# EAGLE design maze_board (EAGLE 9.2.2)
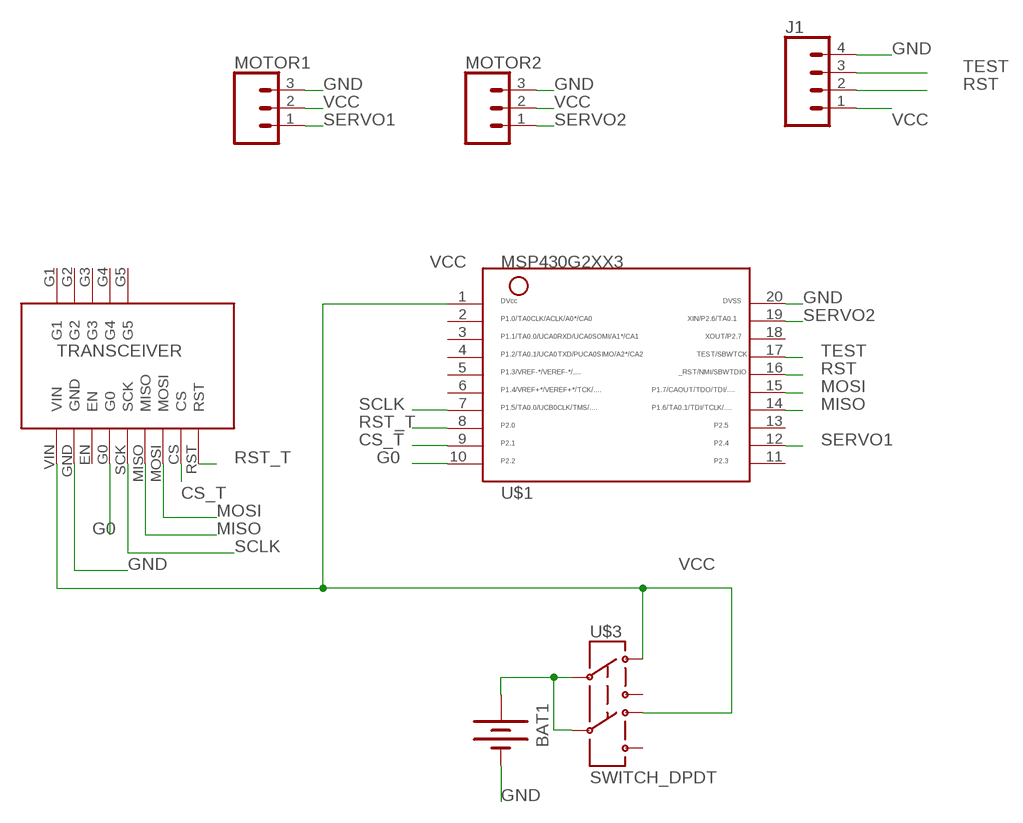
[diagram p0: schematic, sheet 1]

## Parts
BAT1  BATTERY  [BATTERY_PACK_2AA]
J1  CONN_04LOCK  [1X04_LOCK]
MOTOR1  CONN_03LOCK  [1X03_LOCK]
MOTOR2  CONN_03LOCK  [1X03_LOCK]
U$1  MSP430G2XX3TSSOP  [PW20]
U$3  SWITCH_DPDT  [JS_DPDT_TH]
U$4  ADAFRUIT-RFM69HCW-TRANSCEIVER  [ADAFRUIT-RFM69HCW-TRANSCEIVER]

## Nets
CS_T: U$1.9 U$4.CS
G0: U$1.10 U$4.G0
GND: BAT1.GND(-) J1.4 MOTOR1.3 MOTOR2.3 U$1.20 U$4.GND
MISO: U$1.14 U$4.MISO
MOSI: U$1.15 U$4.MOSI
N$2: BAT1.3V(+) U$3.2 U$3.5
RST: J1.2 U$1.16
RST_T: U$1.8 U$4.RST
SCLK: U$1.7 U$4.SCK
SERVO1: MOTOR1.1 U$1.12
SERVO2: MOTOR2.1 U$1.19
TEST: J1.3 U$1.17
VCC: J1.1 MOTOR1.2 MOTOR2.2 U$1.1 U$3.1 U$3.4 U$4.VIN
Unconnected: U$1.2 U$1.3 U$1.4 U$1.5 U$1.6 U$1.11 U$1.13 U$1.18 U$3.3 U$3.6 U$4.EN U$4.G1 U$4.G2 U$4.G3 U$4.G4 U$4.G5

## Library data of the parts
BAT1 = ELEC327:BATTERY: Battery Holders Various common sizes : AA, AAA, 20mm coin cell and 12mm coin cell. 20MM_4LEGS, BATT-10373
J1 = SparkFun-Connectors:CONN_04: Multi connection point. Often used as Generic Header-pin footprint for 0.1 inch spaced/style header connections On any of the 0.1 inch spaced packages, you can populate with these: Break Away Headers - Straight <https://www.sparkfun.com/products/116> (PRT-00116) Break Away Male Headers - Right Angle <https://www.sparkfun.com/products/553> (PRT-00553) Female Headers <https://www.sparkfun.com/products/115> (PRT-00115) Break Away Headers - Machine Pin <https://www.sparkfun.com/products/117> (PRT-00117) Break Away Female Headers - Swiss Machine Pin <https://www.sparkfun.com/products/743> (PRT-00743) For SCREWTERMINALS and SPRING TERMINALS visit here: Screw Terimnals on SparkFun.com <https://www.sparkfun.com/search/results?term=Screw+Terminals> (5mm/3.5mm/2.54mm spacing) This device is also useful as a general connection point to wire up your design to another part of your project. Our various solder wires solder well into these plated through hole pads. Hook-Up Wire - Assortment (Stranded, 22 AWG) <https://www.sparkfun.com/products/11375> (PRT-11375) Hook-Up Wire - Assortment (Solid Core, 22 AWG) <https://www.sparkfun.com/products/11367> (PRT-11367) View the entire wire category on our website here <https://www.sparkfun.com/categories/141> Special notes: Molex polarized connector foot print use with SKU : PRT-08231 with associated crimp pins and housings. 1MM SMD Version SKU: PRT-10208; PROD_ID: CONN-09696
MOTOR1 MOTOR2 = SparkFun-Connectors:CONN_03: Multi connection point. Often used as Generic Header-pin footprint for 0.1 inch spaced/style header connections On any of the 0.1 inch spaced packages, you can populate with these: Break Away Headers - Straight <https://www.sparkfun.com/products/116> (PRT-00116) Break Away Male Headers - Right Angle <https://www.sparkfun.com/products/553> (PRT-00553) Female Headers <https://www.sparkfun.com/products/115> (PRT-00115) Break Away Headers - Machine Pin <https://www.sparkfun.com/products/117> (PRT-00117) Break Away Female Headers - Swiss Machine Pin <https://www.sparkfun.com/products/743> (PRT-00743) Stackable Header - 3 Pin (Female, 0.1") <https://www.sparkfun.com/products/13875> (PRT-13875) For SCREWTERMINALS and SPRING TERMINALS visit here: Screw Terimnals on SparkFun.com <https://www.sparkfun.com/search/results?term=Screw+Terminals> (5mm/3.5mm/2.54mm spacing) This device is also useful as a general connection point to wire up your design to another part of your project. Our various solder wires solder well into these plated through hole pads. Hook-Up Wire - Assortment (Stranded, 22 AWG) <https://www.sparkfun.com/products/11375> (PRT-11375) Hook-Up Wire - Assortment (Solid Core, 22 AWG) <https://www.sparkfun.com/products/11367> (PRT-11367) View the entire wire category on our website here <https://www.sparkfun.com/categories/141> Special notes: Molex polarized connector foot print use with SKU : PRT-08232 with associated crimp pins and housings.
U$1 = ELEC327:MSP430G2XX3: MSP430G2XX3 PDIP (N) 20 Pin Package
U$3 = ELEC327:SWITCH_DPDT
U$4 = patrickELEC327:ADAFRUIT-RFM69HCW-TRANSCEIVER

## Board
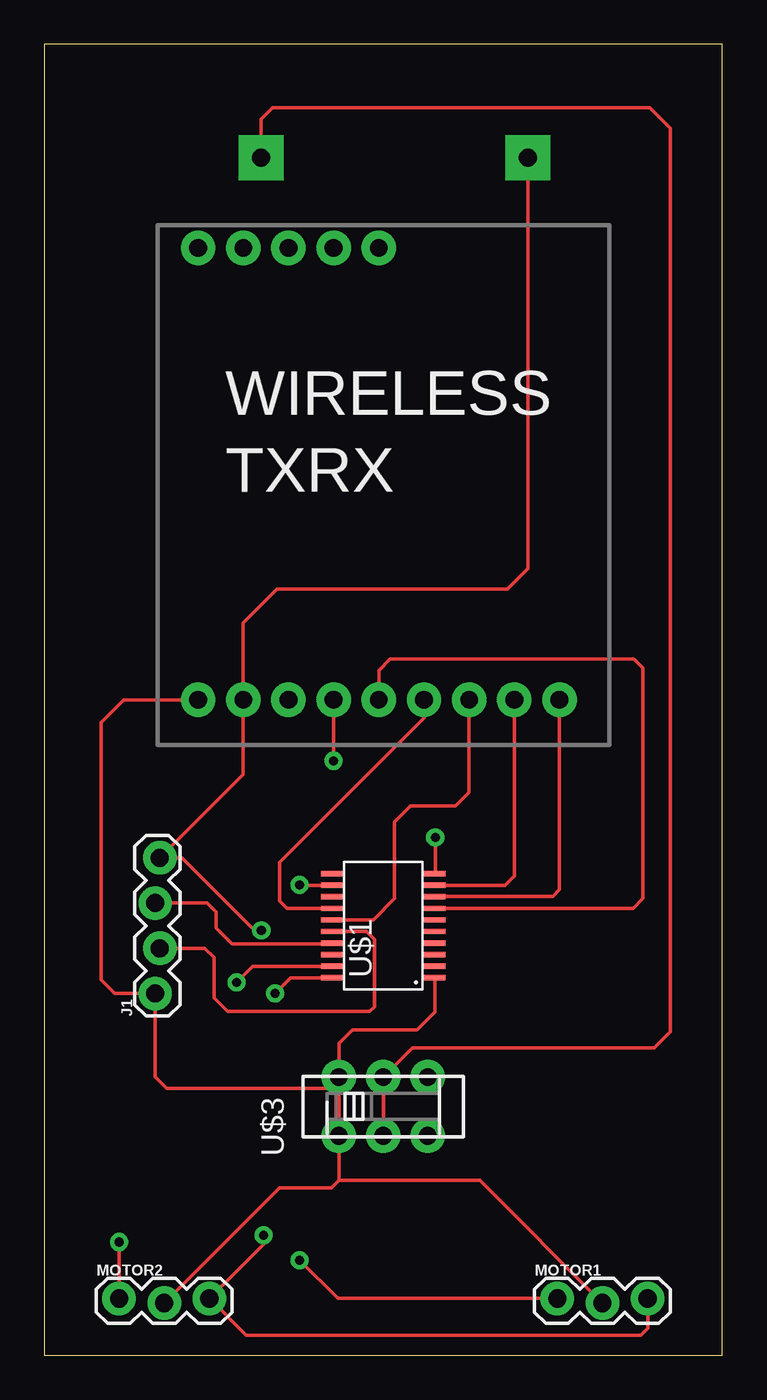
[diagram p1: board, top side]
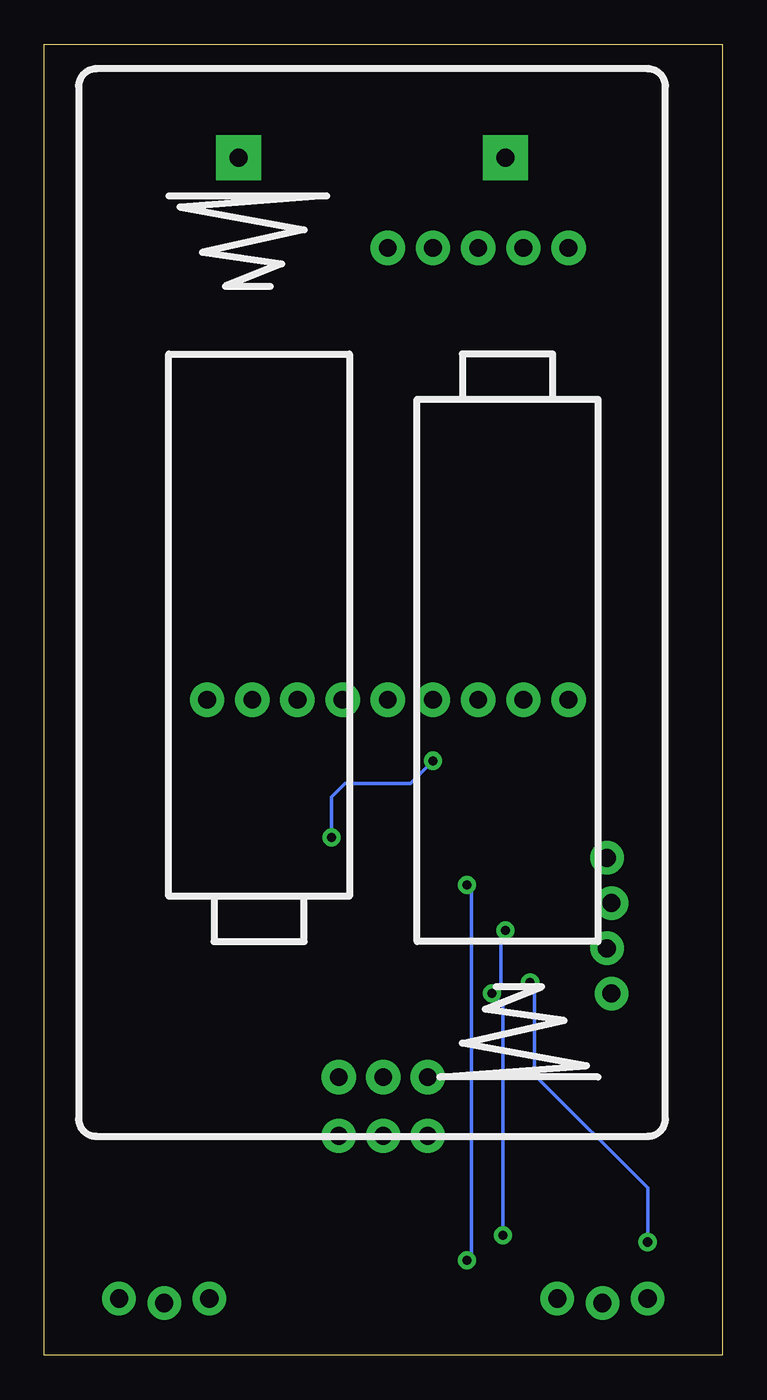
[diagram p2: board, bottom side, seen from below]

Size 38.1 x 73.66 mm. Coordinates in mm from the lower left corner, seen from the top.
Outline: 0,0 38.1,0 38.1,73.66 0,73.66 0,0
Copper layers (1*16): Top 0.035mm / dielectric 1.5mm / Bottom 0.035mm
Design rules "AdvancedCircuitsBarebones": minimum track width 6mil, minimum drill 20mil, track to track 6mil, track to pad 6mil, pad to pad 6mil, via to via 6mil, smd to smd 6mil, copper to edge 10mil, drill to drill 6mil, minimum pad ring 12mil, minimum via ring 10mil, stop-mask expansion 4mil, vias tented up to drill 25mil, thermal gap 10mil

### Footprints (pad centres in the part's own frame; a part is rotated, then mirrored left to right if it is on the bottom)
BATTERY_PACK_2AA = drill 1 pad 2.54 square: 3V 7.5,25; GND -7.5,25
1X04_LOCK = drill 1.016 pad 1.88: 1 0,0.127; 2 2.54,-0.127; 3 5.08,0.127; 4 7.62,-0.127
1X03_LOCK = drill 1.016 pad 1.88: 1 0,0.127; 2 2.54,-0.127; 3 5.08,0.127
PW20 = smd 0.3 x 1.2: 1 -2.925,-2.9; 2 -2.275,-2.9; 3 -1.625,-2.9; 4 -0.975,-2.9; 5 -0.325,-2.9; 6 0.325,-2.9; 7 0.975,-2.9; 8 1.625,-2.9; 9 2.275,-2.9; 10 2.925,-2.9; 11 2.925,2.9; 12 2.275,2.9; 13 1.625,2.9; 14 0.975,2.9; 15 0.325,2.9; 16 -0.325,2.9; 17 -0.975,2.9; 18 -1.625,2.9; 19 -2.275,2.9; 20 -2.925,2.9
JS_DPDT_TH = drill 1 pad 1.93: 1 -2.5,-1.65; 2 0,-1.65; 3 2.5,-1.65; 4 -2.5,1.65; 5 0,1.65; 6 2.5,1.65
ADAFRUIT-RFM69HCW-TRANSCEIVER = drill 1 pad 1.93: CS 20.066,-26.67; EN 7.366,-26.67; G0 9.906,-26.67; G1 2.286,-1.27; G2 4.826,-1.27; G3 7.366,-1.27; G4 9.906,-1.27; G5 12.446,-1.27; GND 4.826,-26.67; MISO 14.986,-26.67; MOSI 17.526,-26.67; RST 22.606,-26.67; SCK 12.446,-26.67; VIN 2.286,-26.67

### Placement (x,y rotation side)
BAT1  19.68,42.29 0 bottom
J1  6.35,20.32 90 top
MOTOR1  28.83,3.05 0 top
MOTOR2  4.19,3.05 0 top
U$1  19.05,24.13 90 top
U$3  19.05,13.97 0 top
U$4  6.35,63.5 0 top

### Tracks (layer width: path | path; a pad name or v marks a point on that pad's centre or on a via)
CS_T
  Top 0.203: U$1.9 25.9,26.41 26.42,26.92 U$4.CS
G0  (via drill 0.51)
  Top 0.203: U$1.10 21.97,27.08 v21.97,29.08 | v16.26,33.4 U$4.G0
  Bottom 0.203: v21.97,29.08 21.97,31.37 21.21,32.13 17.53,32.13 v16.26,33.4
GND  (via drill 0.51)
  Top 0.203: v12.19,23.88 11.81,23.88 7.75,27.94 J1.4 11.18,32.64 U$4.GND 11.18,41.15 13.08,43.05 26.04,43.05 27.18,44.2 BAT1.GND | v12.95,20.32 13.84,21.21 U$1.20 | MOTOR1.3 33.91,1.5 33.53,1.12 11.33,1.12 MOTOR2.3 12.32,6.22 v12.32,6.73
  Bottom 0.203: v12.19,23.88 12.45,23.62 12.45,20.83 v12.95,20.32 12.32,19.68 v12.32,6.73
MISO
  Top 0.203: U$4.MISO 21.34,35.81 13.21,27.69 13.21,25.53 13.63,25.11 U$1.14
MOSI
  Top 0.203: U$1.15 18.49,24.46 19.68,25.65 19.68,29.97 20.57,30.86 23.11,30.86 23.88,31.62 U$4.MOSI
N$2
  Top 0.203: U$3.2 U$3.5 20.7,17.27 34.29,17.27 35.18,18.16 35.18,68.96 34.04,70.1 12.83,70.1 12.19,69.46 BAT1.3V
RST
  Top 0.203: J1.2 9.02,22.86 9.53,22.35 9.53,20.07 10.29,19.3 18.29,19.3 18.54,19.56 18.54,23.37 18.11,23.8 U$1.16
RST_T
  Top 0.203: U$4.RST 28.96,26.16 28.57,25.78 21.98,25.78 U$1.8
SCLK
  Top 0.203: U$4.SCK 18.8,38.48 19.43,39.12 33.15,39.12 33.66,38.61 33.66,25.65 33.11,25.11 U$1.7
SERVO1  (via drill 0.51)
  Top 0.203: MOTOR1.1 16.51,3.17 v14.35,5.33 | v14.35,26.42 14.36,26.41 U$1.12
  Bottom 0.203: v14.35,5.33 14.1,5.59 14.1,26.16 v14.35,26.42
SERVO2  (via drill 0.51)
  Top 0.203: U$1.19 11.7,21.86 v10.79,20.96 | v4.19,6.35 MOTOR2.1
  Bottom 0.203: v10.79,20.96 10.54,20.7 10.54,15.75 4.19,9.4 v4.19,6.35
TEST
  Top 0.203: J1.3 9.14,25.4 9.65,24.89 9.65,24 10.54,23.11 16.11,23.11 U$1.17
VCC
  Top 0.203: U$3.4 U$3.1 16.55,9.82 | U$3.4 15.91,14.98 6.86,14.98 6.22,15.62 J1.1 3.94,20.32 3.17,21.08 3.17,35.56 4.45,36.83 U$4.VIN | U$3.4 16.55,17.52 17.31,18.29 20.95,18.29 21.95,19.28 U$1.1 | MOTOR2.2 13.21,9.4 16.13,9.4 16.55,9.82 | MOTOR1.2 24.47,9.82 16.55,9.82